# EAGLE design ArtroEnergy2.0 (EAGLE 9.2.2)
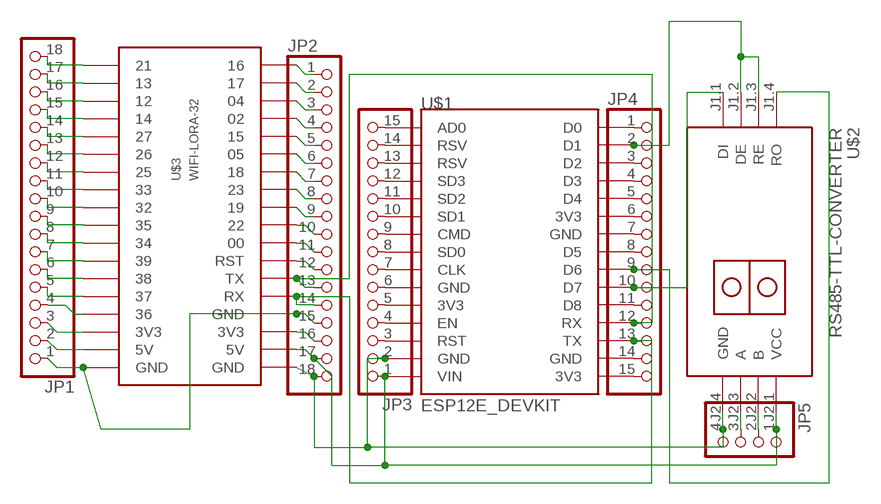
[diagram p0: schematic, sheet 1]

## Parts
JP1  PINHD-1X18  [1X18]
JP2  PINHD-1X18  [1X18]
JP3  PINHD-1X15  [1X15]
JP4  PINHD-1X15  [1X15]
JP5  PINHD-1X4  [1X04]
U$1  ESP12E_DEVKIT  [ESP12E_DEVKIT]
U$2  RS485-TTL-CONVERTER  [RS485-TTL-CONVERTER]
U$3  WIFI-LORA-32  [2.54MM_2X18]

## Nets
3V3@1: JP2.16 U$3.P$3(3V3)
3V3@2: JP1.3 U$3.P$34(3V3)
5V@1: JP2.17 JP3.1 JP5.1 U$1.VIN U$2.J2.1(VCC) U$3.P$2(5V)
5V@2: JP1.2 U$3.P$35(5V)
D0: JP4.10 U$1.D7 U$2.J1.1(DI)
DE_RE: JP4.2 U$1.D1 U$2.J1.2(DE) U$2.J1.3(RE)
GND@1: JP2.18 JP3.2 JP5.4 U$1.GND@1(GND) U$2.J2.4(GND) U$3.P$1(GND)
GND@2: JP1.1 JP2.15 U$3.P$4(GND) U$3.P$36(GND)
N$1: JP1.18 U$3.P$19
N$2: JP1.17 U$3.P$20
N$3: JP1.16 U$3.P$21
N$4: JP1.15 U$3.P$22
N$5: JP1.14 U$3.P$23
N$6: JP1.13 U$3.P$24
N$7: JP1.12 U$3.P$25
N$8: JP1.11 U$3.P$26
N$9: JP1.10 U$3.P$27
N$10: JP1.9 U$3.P$28
N$11: JP1.8 U$3.P$29
N$12: JP1.7 U$3.P$30
N$13: JP1.6 U$3.P$31
N$14: JP1.5 U$3.P$32
N$15: JP1.4 U$3.P$33
N$16: JP2.1 U$3.P$18
N$17: JP2.2 U$3.P$17
N$18: JP2.3 U$3.P$16
N$19: JP2.4 U$3.P$15
N$20: JP2.5 U$3.P$14
N$21: JP2.6 U$3.P$13
N$22: JP2.7 U$3.P$12
N$23: JP2.8 U$3.P$11
N$24: JP2.9 U$3.P$10
N$25: JP2.10 U$3.P$9
N$26: JP2.11 U$3.P$8
N$27: JP2.12 U$3.P$7(RST)
N$28: JP3.3 U$1.RST
N$29: JP3.4 U$1.EN
N$30: JP3.5 U$1.3V3@0(3V3)
N$31: JP3.6 U$1.GND@0(GND)
N$32: JP3.7 U$1.CLK
N$33: JP3.8 U$1.SD0
N$34: JP3.9 U$1.CMD
N$35: JP3.10 U$1.SD1
N$36: JP3.11 U$1.SD2
N$37: JP3.12 U$1.SD3
N$38: JP3.13 U$1.RSV@1(RSV)
N$39: JP3.14 U$1.RSV@0(RSV)
N$40: JP3.15 U$1.AD0
N$41: JP4.1 U$1.D0
N$42: JP4.3 U$1.D2
N$43: JP4.4 U$1.D3
N$44: JP4.5 U$1.D4
N$45: JP4.6 U$1.3V3@1(3V3)
N$46: JP4.7 U$1.GND@2(GND)
N$47: JP4.8 U$1.D5
N$48: JP4.11 U$1.D8
N$49: JP4.14 U$1.GND@3(GND)
N$50: JP4.15 U$1.3V3@2(3V3)
N$51: JP5.2 U$2.J2.2(B)
N$52: JP5.3 U$2.J2.3(A)
RO: JP4.9 U$1.D6 U$2.J1.4(RO)
RX-TX: JP2.14 JP4.13 U$1.TX U$3.P$5(RX)
TX-RX: JP2.13 JP4.12 U$1.RX U$3.P$6(TX)

## Library data of the parts
JP1 JP2 = pinhead:PINHD-1X18: PIN HEADER
JP3 JP4 = pinhead:PINHD-1X15: PIN HEADER
JP5 = pinhead:PINHD-1X4: PIN HEADER
U$1 = ESP12E_DEVKIT:ESP12E_DEVKIT: ESP12E DEVKIT BOARD
U$2 = diy-modules:RS485-TTL-CONVERTER: RS485 to TTL converter based on MAX485 chip
U$3 = ESP32_modules:WIFI-LORA-32

## Board
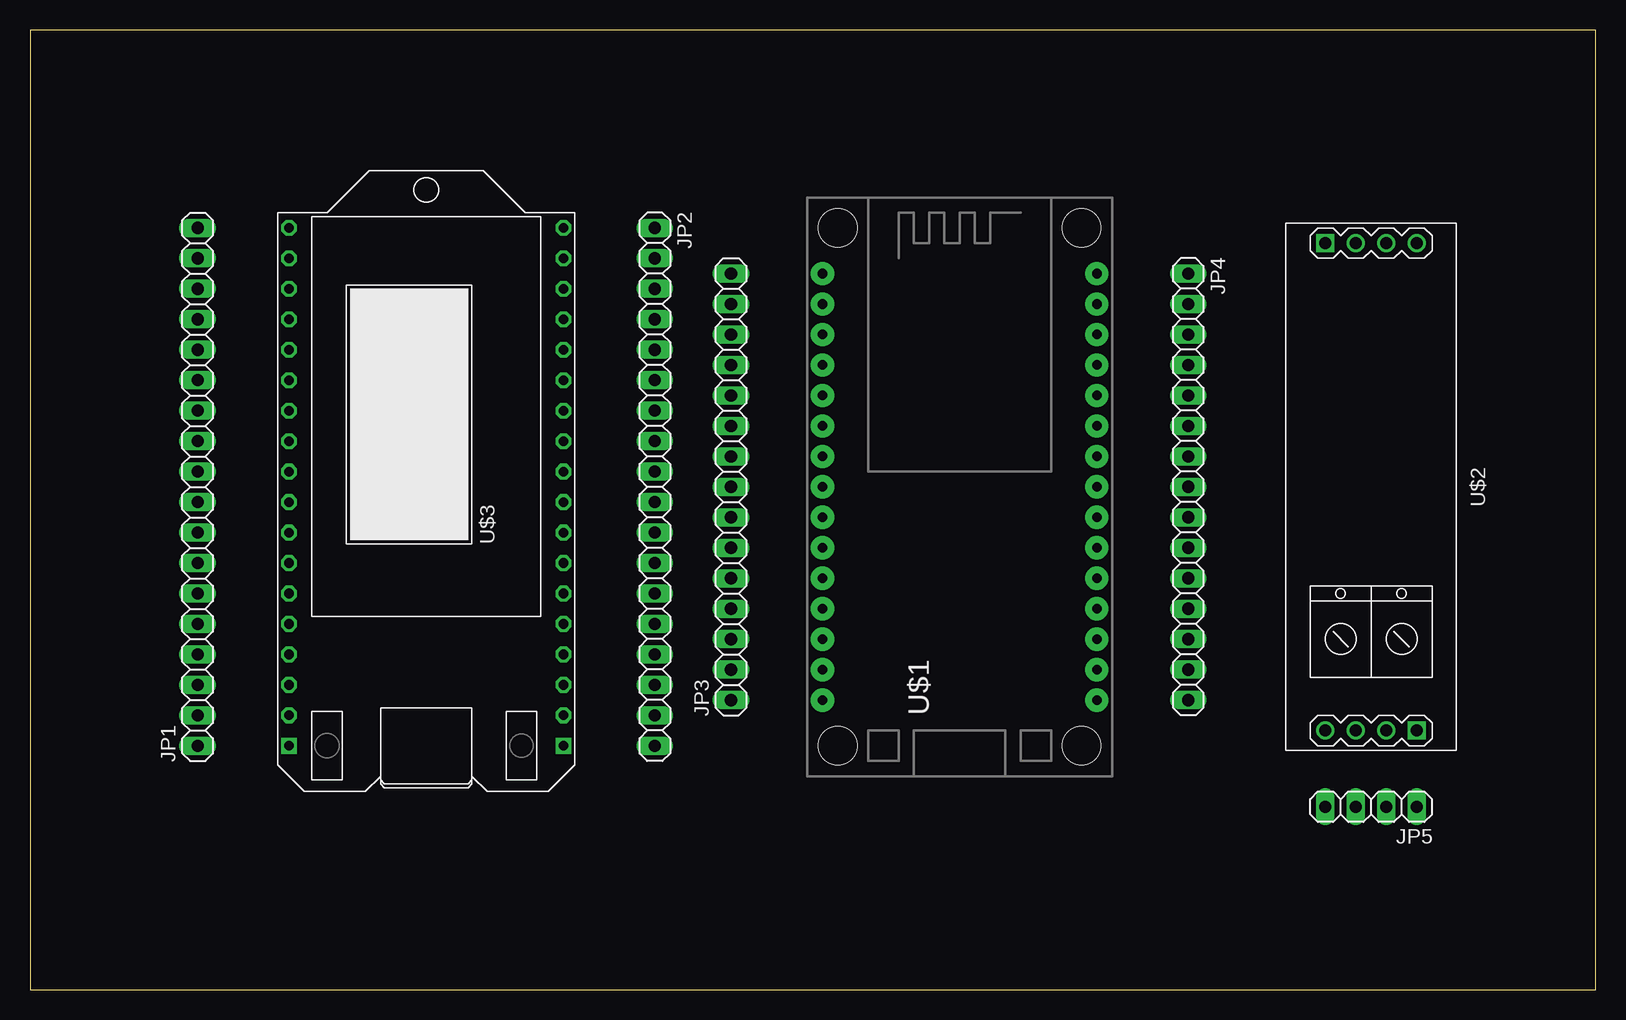
[diagram p1: board, top side]
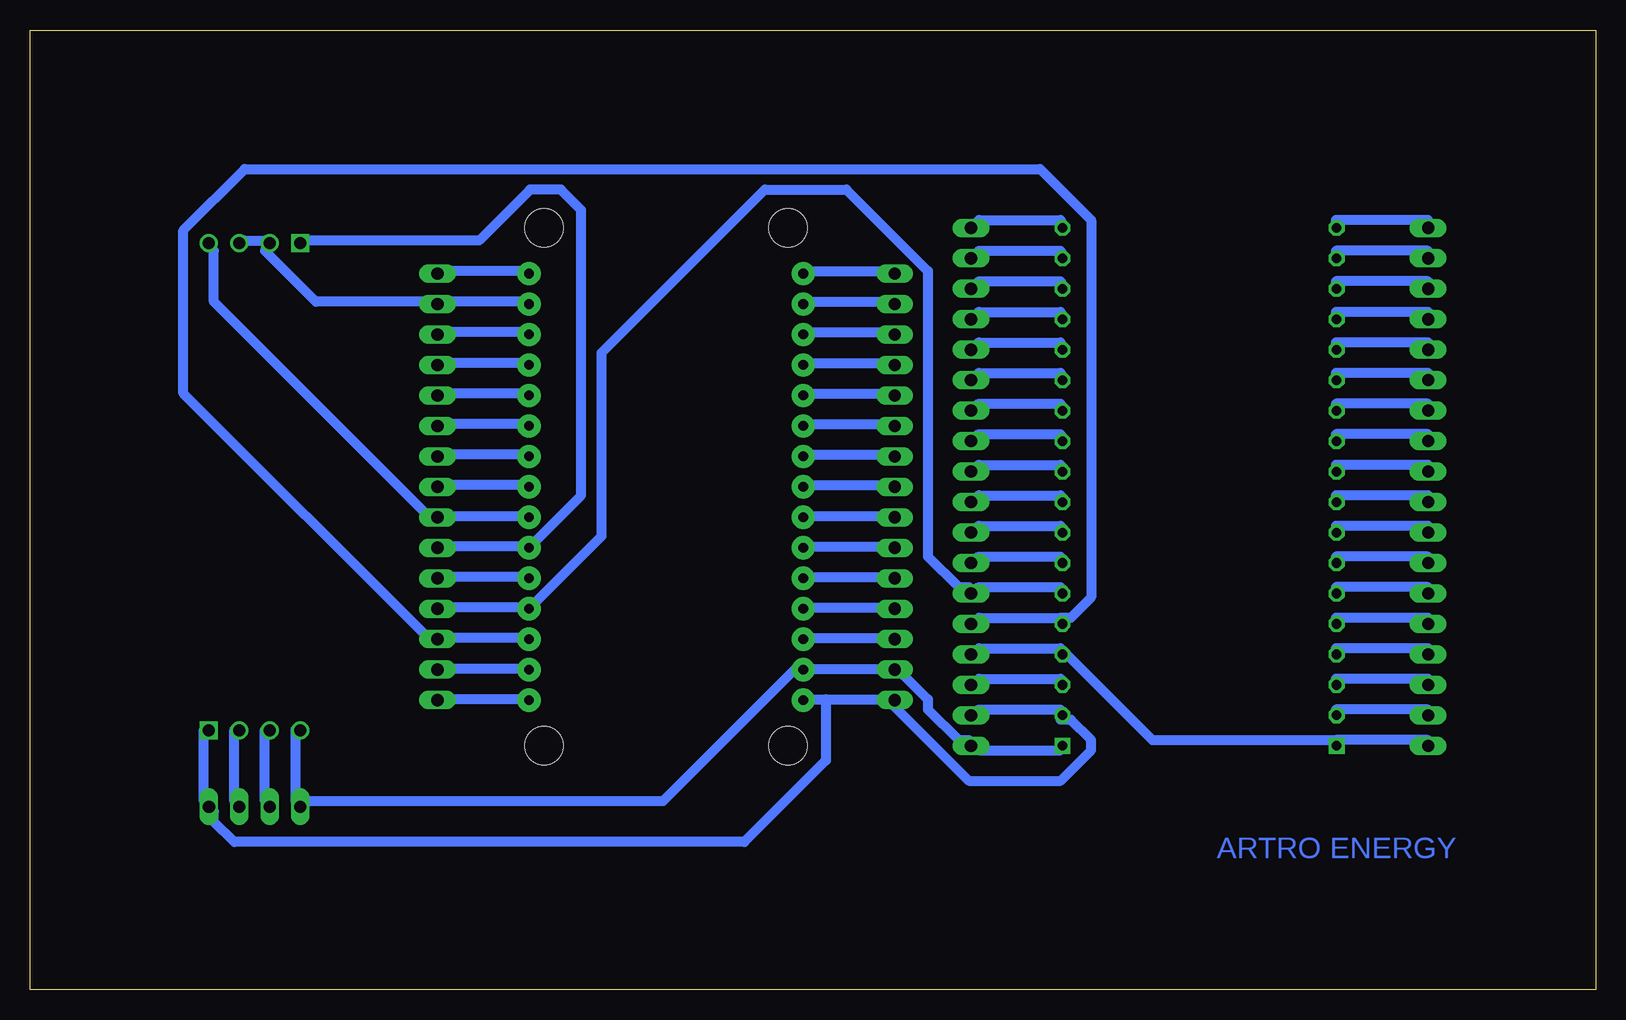
[diagram p2: board, bottom side, seen from below]

Size 130.48 x 80 mm. Coordinates in mm from the lower left corner, seen from the top.
Outline: 0,0 130.48,0 130.48,80 0,80 0,0
Copper layers (1*16): Top 0.035mm / dielectric 1.5mm / Bottom 0.035mm
Design rules "default *": minimum track width 0.85mm, minimum drill 0.35mm, track to track 0.85mm, track to pad 6mil, pad to pad 6mil, via to via 6mil, smd to smd 6mil, copper to edge 40mil, drill to drill 6mil, minimum pad ring 10mil, minimum via ring 8mil, stop-mask expansion 4mil, vias tented up to drill 0mil, thermal gap 10mil

### Footprints (pad centres in the part's own frame; a part is rotated, then mirrored left to right if it is on the bottom)
1X18 = drill 1.016 long: 1 -21.59,0; 2 -19.05,0; 3 -16.51,0; 4 -13.97,0; 5 -11.43,0; 6 -8.89,0; 7 -6.35,0; 8 -3.81,0; 9 -1.27,0; 10 1.27,0; 11 3.81,0; 12 6.35,0; 13 8.89,0; 14 11.43,0; 15 13.97,0; 16 16.51,0; 17 19.05,0; 18 21.59,0
1X15 = drill 1.016 long: 1 -17.78,0; 2 -15.24,0; 3 -12.7,0; 4 -10.16,0; 5 -7.62,0; 6 -5.08,0; 7 -2.54,0; 8 0,0; 9 2.54,0; 10 5.08,0; 11 7.62,0; 12 10.16,0; 13 12.7,0; 14 15.24,0; 15 17.78,0
1X04 = drill 1.016 long: 1 -3.81,0; 2 -1.27,0; 3 1.27,0; 4 3.81,0
ESP12E_DEVKIT = drill 0.8 pad 1.93: 3V3@0 -11.43,-7.62; 3V3@1 11.43,5.08; 3V3@2 11.43,-17.78; AD0 -11.43,17.78; CLK -11.43,-2.54; CMD -11.43,2.54; D0 11.43,17.78; D1 11.43,15.24; D2 11.43,12.7; D3 11.43,10.16; D4 11.43,7.62; D5 11.43,0; D6 11.43,-2.54; D7 11.43,-5.08; D8 11.43,-7.62; EN -11.43,-10.16; GND@0 -11.43,-5.08; GND@1 -11.43,-15.24; GND@2 11.43,2.54; GND@3 11.43,-15.24; RST -11.43,-12.7; RSV@0 -11.43,15.24; RSV@1 -11.43,12.7; RX 11.43,-10.16; SD0 -11.43,0; SD1 -11.43,5.08; SD2 -11.43,7.62; SD3 -11.43,10.16; TX 11.43,-12.7; VIN -11.43,-17.78 | hole 3.2: -10.16,21.59; 10.16,21.59; 10.16,-21.59; -10.16,-21.59
RS485-TTL-CONVERTER = drill 1 square: J1.1 -20.32,-3.81; J2.1 20.32,3.81 | drill 1: J1.2 -20.32,-1.27; J1.3 -20.32,1.27; J1.4 -20.32,3.81; J2.2 20.32,1.27; J2.3 20.32,-1.27; J2.4 20.32,-3.81
2.54MM_2X18 = drill 0.8 square: P$1 -20.32,-11.43; P$36 -20.32,11.43 | drill 0.8 octagon: P$2 -17.78,-11.43; P$3 -15.24,-11.43; P$4 -12.7,-11.43; P$5 -10.16,-11.43; P$6 -7.62,-11.43; P$7 -5.08,-11.43; P$8 -2.54,-11.43; P$9 0,-11.43; P$10 2.54,-11.43; P$11 5.08,-11.43; P$12 7.62,-11.43; P$13 10.16,-11.43; P$14 12.7,-11.43; P$15 15.24,-11.43; P$16 17.78,-11.43; P$17 20.32,-11.43; P$18 22.86,-11.43; P$19 22.86,11.43; P$20 20.32,11.43; P$21 17.78,11.43; P$22 15.24,11.43; P$23 12.7,11.43; P$24 10.16,11.43; P$25 7.62,11.43; P$26 5.08,11.43; P$27 2.54,11.43; P$28 0,11.43; P$29 -2.54,11.43; P$30 -5.08,11.43; P$31 -7.62,11.43; P$32 -10.16,11.43; P$33 -12.7,11.43; P$34 -15.24,11.43; P$35 -17.78,11.43

### Placement (x,y rotation side)
JP1  13.97,41.91 90 top
JP2  52.07,41.91 270 top
JP3  58.42,41.91 90 top
JP4  96.52,41.91 270 top
JP5  111.76,15.24 180 top
U$1  77.47,41.91 0 top
U$2  111.76,41.91 270 top
U$3  33.02,40.64 90 top

### Tracks (layer width: path | path; a pad name or v marks a point on that pad's centre or on a via)
3V3@1
  Bottom 0.85: U$3.P$3 44.6,25.9 51.4,25.9 JP2.16
3V3@2
  Bottom 0.85: U$3.P$34 21.65,25.9 14,25.9 JP1.3
5V@1
  Bottom 0.85: JP2.17 51.4,23.35 44.6,23.35 U$3.P$2 44.6,22.5 43.75,22.5 42.05,20.8 42.05,19.95 44.6,17.4 52.25,17.4 59.05,24.2 | U$2.J2.1 116,21.65 116,15.7 JP5.1 115.15,14.85 115.15,14 113.45,12.3 70.95,12.3 64.15,19.1 64.15,24.2 | 64.15,24.2 65.85,24.2 U$1.VIN | 64.15,24.2 59.05,24.2 | 59.05,24.2 JP3.1
5V@2
  Bottom 0.85: U$3.P$35 21.65,23.35 14,23.35 JP1.2
D0
  Bottom 0.85: U$2.J1.1 107.5,62.45 93.05,62.45 88.8,66.7 86.25,66.7 84.55,65 84.55,41.2 88.8,36.95 U$1.D7 89.65,36.95 96.45,36.95 JP4.10
DE_RE
  Bottom 0.85: U$2.J1.3 112.6,62.45 110.9,62.45 U$2.J1.2 110.9,61.6 106.65,57.35 97.3,57.35 JP4.2 96.45,57.35 89.65,57.35 U$1.D1
GND@1
  Bottom 0.85: U$3.P$1 44.6,19.95 51.4,19.95 JP2.18 52.25,20.8 53.1,20.8 55.65,23.35 55.65,24.2 58.2,26.75 JP3.2 59.05,26.75 65.85,26.75 U$1.GND@1 66.7,26.75 77.75,15.7 107.5,15.7 JP5.4 108.35,15.7 108.35,21.65 U$2.J2.4
GND@2
  Bottom 0.85: 21.65,20.8 14,20.8 JP1.1 | 44.6,28.45 51.4,28.45 JP2.15 | 21.65,20.8 36.95,20.8 44.6,28.45 | 21.65,20.8 U$3.P$36 | 44.6,28.45 U$3.P$4
N$1
  Bottom 0.85: U$3.P$19 21.65,64.15 14,64.15 JP1.18
N$2
  Bottom 0.85: U$3.P$20 21.65,61.6 14,61.6 JP1.17
N$3
  Bottom 0.85: U$3.P$21 21.65,59.05 14,59.05 JP1.16
N$4
  Bottom 0.85: U$3.P$22 21.65,56.5 14,56.5 JP1.15
N$5
  Bottom 0.85: U$3.P$23 21.65,53.95 14,53.95 JP1.14
N$6
  Bottom 0.85: U$3.P$24 21.65,51.4 14,51.4 JP1.13
N$7
  Bottom 0.85: U$3.P$25 21.65,48.85 14,48.85 JP1.12
N$8
  Bottom 0.85: U$3.P$26 21.65,46.3 14,46.3 JP1.11
N$9
  Bottom 0.85: U$3.P$27 21.65,43.75 14,43.75 JP1.10
N$10
  Bottom 0.85: U$3.P$28 21.65,41.2 14,41.2 JP1.9
N$11
  Bottom 0.85: U$3.P$29 21.65,38.65 14,38.65 JP1.8
N$12
  Bottom 0.85: U$3.P$30 21.65,36.1 14,36.1 JP1.7
N$13
  Bottom 0.85: U$3.P$31 21.65,33.55 14,33.55 JP1.6
N$14
  Bottom 0.85: U$3.P$32 21.65,31 14,31 JP1.5
N$15
  Bottom 0.85: U$3.P$33 21.65,28.45 14,28.45 JP1.4
N$16
  Bottom 0.85: U$3.P$18 44.6,64.15 51.4,64.15 JP2.1
N$17
  Bottom 0.85: U$3.P$17 44.6,61.6 51.4,61.6 JP2.2
N$18
  Bottom 0.85: U$3.P$16 44.6,59.05 51.4,59.05 JP2.3
N$19
  Bottom 0.85: U$3.P$15 44.6,56.5 51.4,56.5 JP2.4
N$20
  Bottom 0.85: U$3.P$14 44.6,53.95 51.4,53.95 JP2.5
N$21
  Bottom 0.85: U$3.P$13 44.6,51.4 51.4,51.4 JP2.6
N$22
  Bottom 0.85: U$3.P$12 44.6,48.85 51.4,48.85 JP2.7
N$23
  Bottom 0.85: U$3.P$11 44.6,46.3 51.4,46.3 JP2.8
N$24
  Bottom 0.85: U$3.P$10 44.6,43.75 51.4,43.75 JP2.9
N$25
  Bottom 0.85: U$3.P$9 44.6,41.2 51.4,41.2 JP2.10
N$26
  Bottom 0.85: U$3.P$8 44.6,38.65 51.4,38.65 JP2.11
N$27
  Bottom 0.85: U$3.P$7 44.6,36.1 51.4,36.1 JP2.12
N$28
  Bottom 0.85: JP3.3 59.05,29.3 65.85,29.3 U$1.RST
N$29
  Bottom 0.85: JP3.4 59.05,31.85 65.85,31.85 U$1.EN
N$30
  Bottom 0.85: JP3.5 59.05,34.4 65.85,34.4 U$1.3V3@0
N$31
  Bottom 0.85: JP3.6 59.05,36.95 65.85,36.95 U$1.GND@0
N$32
  Bottom 0.85: JP3.7 59.05,39.5 65.85,39.5 U$1.CLK
N$33
  Bottom 0.85: JP3.8 59.05,42.05 65.85,42.05 U$1.SD0
N$34
  Bottom 0.85: JP3.9 59.05,44.6 65.85,44.6 U$1.CMD
N$35
  Bottom 0.85: JP3.10 59.05,47.15 65.85,47.15 U$1.SD1
N$36
  Bottom 0.85: JP3.11 59.05,49.7 65.85,49.7 U$1.SD2
N$37
  Bottom 0.85: JP3.12 59.05,52.25 65.85,52.25 U$1.SD3
N$38
  Bottom 0.85: JP3.13 59.05,54.8 65.85,54.8 U$1.RSV@1
N$39
  Bottom 0.85: JP3.14 59.05,57.35 65.85,57.35 U$1.RSV@0
N$40
  Bottom 0.85: JP3.15 59.05,59.9 65.85,59.9 U$1.AD0
N$41
  Bottom 0.85: JP4.1 96.45,59.9 89.65,59.9 U$1.D0
N$42
  Bottom 0.85: JP4.3 96.45,54.8 89.65,54.8 U$1.D2
N$43
  Bottom 0.85: JP4.4 96.45,52.25 89.65,52.25 U$1.D3
N$44
  Bottom 0.85: JP4.5 96.45,49.7 89.65,49.7 U$1.D4
N$45
  Bottom 0.85: JP4.6 96.45,47.15 89.65,47.15 U$1.3V3@1
N$46
  Bottom 0.85: JP4.7 96.45,44.6 89.65,44.6 U$1.GND@2
N$47
  Bottom 0.85: JP4.8 96.45,42.05 89.65,42.05 U$1.D5
N$48
  Bottom 0.85: JP4.11 96.45,34.4 89.65,34.4 U$1.D8
N$49
  Bottom 0.85: JP4.14 96.45,26.75 89.65,26.75 U$1.GND@3
N$50
  Bottom 0.85: JP4.15 96.45,24.2 89.65,24.2 U$1.3V3@2
N$51
  Bottom 0.85: U$2.J2.2 113.45,21.65 113.45,15.7 JP5.2
N$52
  Bottom 0.85: U$2.J2.3 110.9,21.65 110.9,15.7 JP5.3
RO
  Bottom 0.85: U$2.J1.4 115.15,61.6 115.15,57.35 97.3,39.5 JP4.9 96.45,39.5 89.65,39.5 U$1.D6
RX-TX
  Bottom 0.85: 44.6,31 51.4,31 JP2.14 | U$1.TX 89.65,29.3 96.45,29.3 JP4.13 97.3,29.3 117.7,49.7 117.7,63.3 112.6,68.4 46.3,68.4 42.05,64.15 42.05,32.7 43.75,31 44.6,31 | 44.6,31 U$3.P$5
TX-RX
  Bottom 0.85: U$3.P$6 44.6,33.55 51.4,33.55 JP2.13 52.25,33.55 53.1,33.55 55.65,36.1 55.65,59.9 62.45,66.7 69.25,66.7 82.85,53.1 82.85,37.8 U$1.RX 89.65,31.85 96.45,31.85 JP4.12

### Text on the board
Bottom: ARTRO ENERGY